# EasyEDA schematic SCH_towed-rov_2022-04-12.json
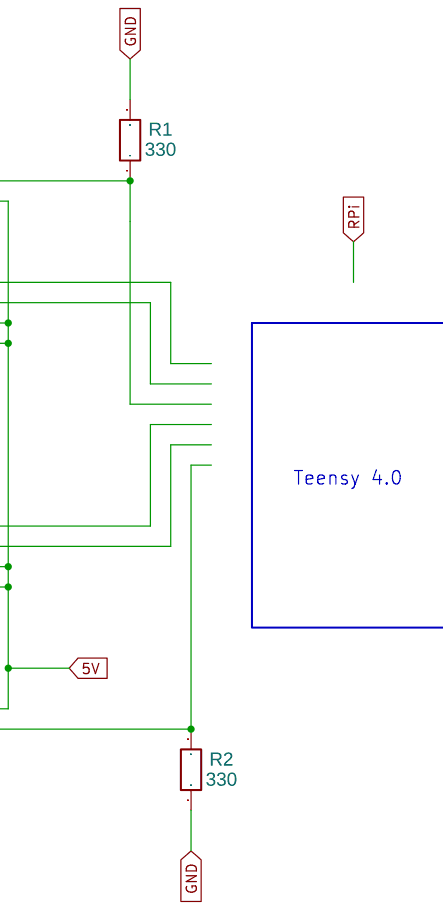
[diagram p0: schematic sheet]

## Parts
R1  330  [R0603]
R2  330  [R0603]

## Library data of the parts
R1 R2 = R_0603_EU: Contributor: LCEDA_Lib

## Nets
GND: R1.2 R2.1

Not connected (* = marked no-connect by the designer): R1 1; R2 2

## Notes on the sheet
- Motor box starboard side
- Reed switch
- Stepper
- Stepper driver 1
- X1
- Motor box port side
- Underwater data cable
- Stepper driver 2
- Teensy 4.0
- Stepper
- Reed switch
- TITLE:
- Towed-ROV stepper
- REV:
- 1.0
- Company:
- NTNU
- Sheet:
- 1/1
- Date:
- 12.04.2022
- Drawn By:
- William Hammer
